# EAGLE design All (EAGLE 8.3.0)
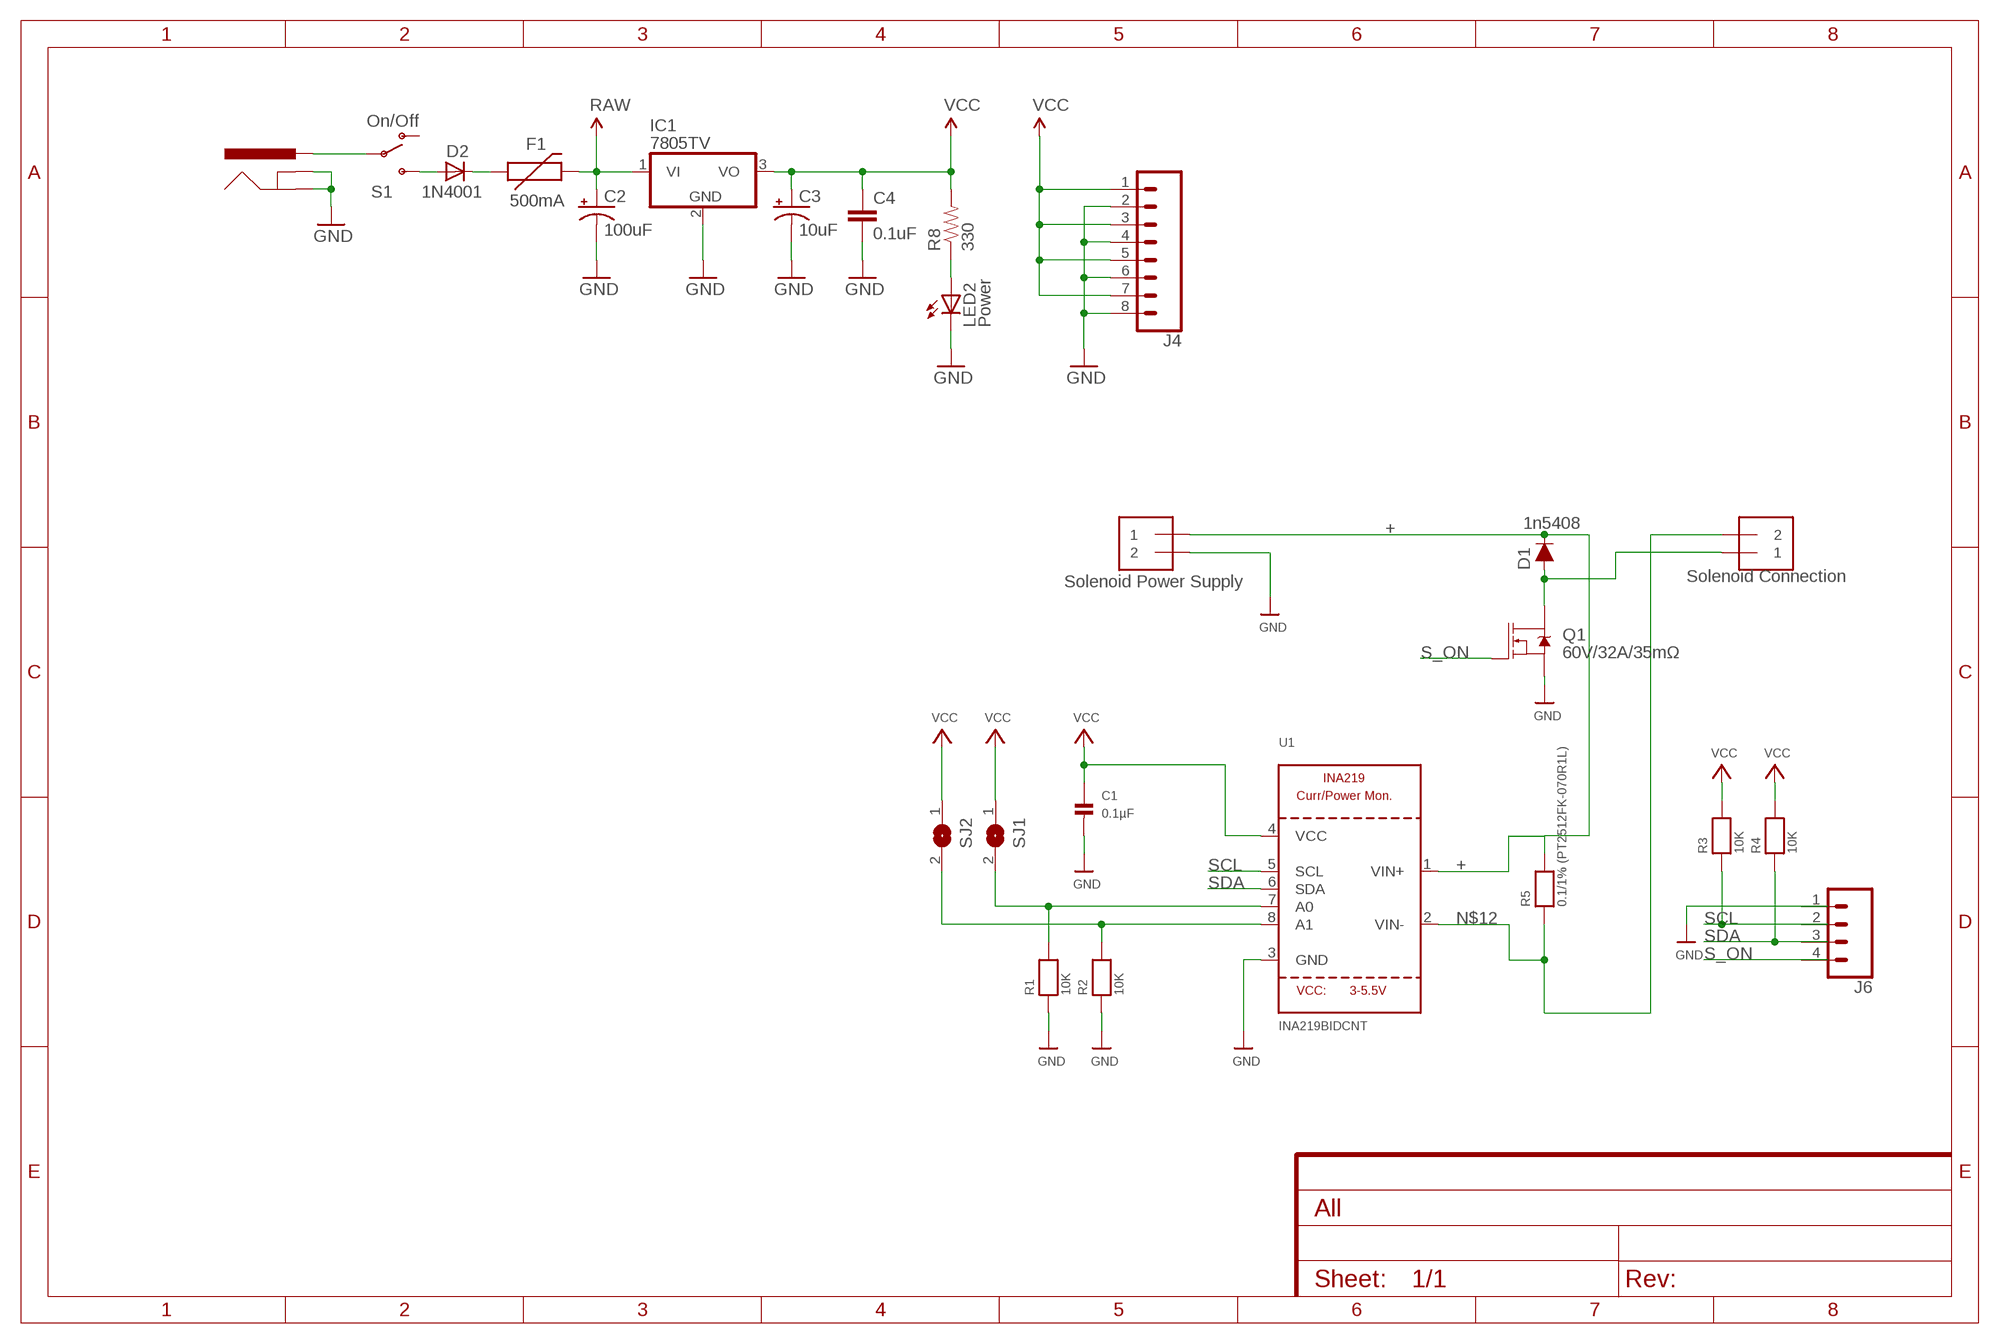
[diagram p0: schematic, sheet 1]

## Parts
C1  0.1µF  CAP_CERAMIC0805  [0805]
C2  100uF  CAP_POLPTH1  [CPOL-RADIAL-100UF-25V]
C3  10uF  CAP_POLPTH2  [CPOL-RADIAL-10UF-25V]
C4  0.1uF  CAPPTH2  [CAP-PTH-SMALL2]
D1  DIODE-1N4148  [DIODE-1N4148]
D2  1N4001  DIODEPTH  [DIODE-0.4]
F1  500mA  PTCPTH  [PTC]
IC1  7805TV  [TO220V]
J1  POWER_JACKPTH  [POWER_JACK_PTH]
J2  TERMBLOCK_1X2-3.5MM  [1X2-3.5MM]
J3  TERMBLOCK_1X2-3.5MM  [1X2-3.5MM]
J4  CONN_08"  [1X08]
J6  CONN_04  [1X04]
LED2  Power  LED5MM  [LED5MM]
Q1  60V/32A/35mΩ  MOSFET-NCH-FQP30N06L  [TO220V]
R1  10K  RESISTOR0805  [0805]
R2  10K  RESISTOR0805  [0805]
R3  10K  RESISTOR0805  [0805]
R4  10K  RESISTOR0805  [0805]
R5  0.1/1% (PT2512FK-070R1L)  RESISTOR2512  [2512]
R8  330  RESISTORPTH1  [AXIAL-0.3]
S1  On/Off  SWITCH-SPSTPTH  [SWITCH-SPST]
SJ1  SOLDERJUMPERREFLOW_NOPASTE  [SOLDERJUMPER_REFLOW_NOPASTE]
SJ2  SOLDERJUMPERREFLOW_NOPASTE  [SOLDERJUMPER_REFLOW_NOPASTE]
U1  INA219BIDCNT  INA219  [SOT23-8]

## Nets
+: D1.C J2.1 R5.2 U1.1(VIN+)
GND: C1.2 C2.2(-) C3.2(-) C4.2 IC1.2(GND) J1.GND J1.GNDBREAK J2.2 J4.2 J4.4 J4.6 J4.8 J6.1 LED2.K(C) Q1.3(S) R1.1 R2.1 U1.3(GND)
N$1: R2.2 SJ2.2 U1.8(A1)
N$2: R1.2 SJ1.2 U1.7(A0)
N$4: D1.A J3.1 Q1.2(D)
N$8: J1.PWR S1.2(P)
N$9: LED2.A R8.P$1
N$10: D2.C F1.P$1
N$11: D2.A S1.3(S)
N$12: J3.2 R5.1 U1.2(VIN-)
RAW: C2.1(+) F1.P$2 IC1.1(VI)
S_ON: J6.4 Q1.1(G)
SCL: J6.2 R3.1 U1.5(SCL)
SDA: J6.3 R4.1 U1.6(SDA)
VCC: C1.1 C3.1(+) C4.1 IC1.3(VO) J4.1 J4.3 J4.5 J4.7 R3.2 R4.2 R8.P$2 SJ1.1 SJ2.1 U1.4(VCC)
Unconnected: S1.1(O)

## Library data of the parts
C1 = microbuilder:CAP_CERAMIC: Ceramic Capacitors 0402 - 0402 Surface Mount Capacitors 16pF 50V 5% [Digikey: 445-4899-2-ND] 18pF 50V 5% [Digikey: 490-1281-2-ND] 22pF 50V 5% [Digikey: 490-1283-2-ND] 68pF 50V 5% [Digikey: 490-1289-2-ND] 0.1uF 10V 10% [Digikey: 490-1318-2-ND] 1.0uF 6.3V 10% [Digikey: 490-1320-2-ND] 0603 - 0603 Surface Mount Capacitors 16 pF 50V 5% [Digikey: 445-5051-2-ND] 22 pF 50V [Digikey: PCC220ACVTR-ND] 33 pF 50V 5% [Digikey: 490-1415-1-ND] 56pF 50V 5% [Digikey: 490-1421-1-ND] 220pF 50V 5% [Digikey: 445-1285-1-ND] 680 pF 50V 2200 pF 50V 5% C0G [Digikey: 445-1297-1-ND] 5600 pF 100V 5% X7R [Digikey: 478-3711-1-ND] 0.1 µF 25V 10% [Digikey: PCC2277TR-ND] 0.22 µF 16V 10% X7R [Digikey: 445-1318-1-ND] 1.0 µF 25V 10% [Digikey: 445-5146-2-ND] 0603 - RF Specific 3pF 250V +/-0.1pF RF [Digikey: 712-1347-1-ND] 18 pF 250V 5% [Digikey: 478-3505-1-ND or 712-1322-1-ND] 56 pF 250V 5% C0G RF [Digikey: 490-4867-1-ND] 68 pF 250V RF [Digikey: 490-4868-1-ND] 0805 - 0805 Surface Mount Capacitors 220 pF 250V 2% RF Ceramic Capacitor [Digikey: 712-1398-1-ND] 1000 pF 50V 2% NP0 Ceramic Capacitor [Digikey: 478-3760-1-ND] 0.1 µF 25V 10% Ceramic Capacitor [Digikey: PCC1828TR-ND] 1.0 µF 16V 10% Ceramic Capacitor[Digikey: 490-1691-2-ND] 10.0 µF 10V 10% Ceramic Capacitor[Digikey: 709-1228-1-ND] 10.0 uF 16V 10% Ceramic Capacitor [Digikey: 478-5165-2-ND] 47 uF 6.3V 20% Ceramic Capacitor [Digikey: 587-1779-1-ND or 399-5506-1-ND] 1206 - 1206 Surface Mount Capacitors 47uF 10V 20% Ceramic Capacitor [Digikey: 490-5528-1-ND or 399-5508-1-ND or 445-6010-1-ND] 100uF 6.3V -20%, +80% Y5V Ceramic Capacitor (Digikey: 490-4512-1-ND, Mouser: 81-GRM31CF50J107ZE1L)
C2 C3 = SparkFun:CAP_POL: Capacitor Polarized These are standard SMD and PTH capacitors. Normally 10uF, 47uF, and 100uF in electrolytic and tantalum varieties. Always verify the external diameter of the through hole cap, it varies with capacity, voltage, and manufacturer. The EIA devices should be standard.
C4 = SparkFun:CAP: Capacitor Standard 0603 ceramic capacitor, and 0.1" leaded capacitor.
D1 = SparkFun-DiscreteSemi:DIODE: Diode; PROD_ID: DIO-08378; TEMP: 1n5408; VALUE: 200mA/100V/1V
D2 = SparkFun:DIODE: Diode
F1 = SparkFun:PTC: Resettable Fuse PTC Resettable Fuse. Spark Fun Electronics SKU : COM-08357
IC1 = linear:78*: Positive VOLTAGE REGULATOR Source: http://cache.national.com/ds/LM/LM78L05.pdf http://www.fairchildsemi.com/ds/LM/LM7805.pdf
J1 = SparkFun:POWER_JACK: Power Jack This is the standard 5.5mm barrel jack for power. The PTH is the most common, proven, reliable, footprint. All others are experimental. The Slot footprint only works if the mill layer is transmitted to the PCB fab house so be warned. Spark Fun Electronics SKU : PRT-00119. Mating wall wart : TOL-00298 (and others)
J2 = microbuilder:TERMBLOCK_1X2: 3.5mm Terminal block http://www.ladyada.net/library/pcb/eaglelibrary.html; TEMP: Solenoid Power Supply
J3 = microbuilder:TERMBLOCK_1X2: 3.5mm Terminal block http://www.ladyada.net/library/pcb/eaglelibrary.html; TEMP: Solenoid Connection
J4 = SparkFun-Connectors:CONN_08: Multi connection point. Often used as Generic Header-pin footprint for 0.1 inch spaced/style header connections On any of the 0.1 inch spaced packages, you can populate with these: Break Away Headers - Straight <https://www.sparkfun.com/products/116> (PRT-00116) Break Away Male Headers - Right Angle <https://www.sparkfun.com/products/553> (PRT-00553) Female Headers <https://www.sparkfun.com/products/115> (PRT-00115) Break Away Headers - Machine Pin <https://www.sparkfun.com/products/117> (PRT-00117) Break Away Female Headers - Swiss Machine Pin <https://www.sparkfun.com/products/743> (PRT-00743) Arduino Stackable Header - 8 Pin <https://www.sparkfun.com/products/9279> (PRT-09279) For SCREWTERMINALS and SPRING TERMINALS visit here: Screw Terimnals on SparkFun.com <https://www.sparkfun.com/search/results?term=Screw+Terminals> (5mm/3.5mm/2.54mm spacing) This device is also useful as a general connection point to wire up your design to another part of your project. Our various solder wires solder well into these plated through hole pads. Hook-Up Wire - Assortment (Stranded, 22 AWG) <https://www.sparkfun.com/products/11375> (PRT-11375) Hook-Up Wire - Assortment (Solid Core, 22 AWG) <https://www.sparkfun.com/products/11367> (PRT-11367) View the entire wire category on our website here <https://www.sparkfun.com/categories/141> Special notes: Molex polarized connector foot print use with SKU : PRT-08231 with associated crimp pins and housings. 1MM SMD Version SKU: PRT-10208 NOTES ON THE VARIANTS LOCK and LOCK_LONGPADS... This footprint was designed to help hold the alignment of a through-hole component (i.e. 6-pin header) while soldering it into place. You may notice that each hole has been shifted either up or down by 0.005 of an inch from it's more standard position (which is a perfectly straight line). This slight alteration caused the pins (the squares in the middle) to touch the edges of the holes. Because they are alternating, it causes a "brace" to hold the component in place. 0.005 has proven to be the perfect amount of "off-center" position when using our standard breakaway headers. Although looks a little odd when you look at the bare footprint, once you have a header in there, the alteration is very hard to notice. Also,if you push a header all the way into place, it is covered up entirely on the bottom side.; PROD_ID: CONN-08438
J6 = SparkFun-Connectors:CONN_04: Multi connection point. Often used as Generic Header-pin footprint for 0.1 inch spaced/style header connections On any of the 0.1 inch spaced packages, you can populate with these: Break Away Headers - Straight <https://www.sparkfun.com/products/116> (PRT-00116) Break Away Male Headers - Right Angle <https://www.sparkfun.com/products/553> (PRT-00553) Female Headers <https://www.sparkfun.com/products/115> (PRT-00115) Break Away Headers - Machine Pin <https://www.sparkfun.com/products/117> (PRT-00117) Break Away Female Headers - Swiss Machine Pin <https://www.sparkfun.com/products/743> (PRT-00743) For SCREWTERMINALS and SPRING TERMINALS visit here: Screw Terimnals on SparkFun.com <https://www.sparkfun.com/search/results?term=Screw+Terminals> (5mm/3.5mm/2.54mm spacing) This device is also useful as a general connection point to wire up your design to another part of your project. Our various solder wires solder well into these plated through hole pads. Hook-Up Wire - Assortment (Stranded, 22 AWG) <https://www.sparkfun.com/products/11375> (PRT-11375) Hook-Up Wire - Assortment (Solid Core, 22 AWG) <https://www.sparkfun.com/products/11367> (PRT-11367) View the entire wire category on our website here <https://www.sparkfun.com/categories/141> Special notes: Molex polarized connector foot print use with SKU : PRT-08231 with associated crimp pins and housings. 1MM SMD Version SKU: PRT-10208; PROD_ID: CONN-09696
LED2 = SparkFun-Nate:LED
Q1 = SparkFun-DiscreteSemi:MOSFET-NCH: N-channel MOSFETs Voltage controlled devices that allow control of high current outputs. SparkFun Products: SparkFun OpenScale <https://www.sparkfun.com/products/13261> SparkFun Digital Sandbox <https://www.sparkfun.com/products/12651> SparkFun Monster Moto Shield <https://www.sparkfun.com/products/10182> SparkFun MOSFET Power Controller <https://www.sparkfun.com/products/11214>; PROD_ID: TRANS-10060
R1-R5 = microbuilder:RESISTOR: Resistors 0402 - 0402 Surface Mount Package 22 Ohm 1% 1/16W [Digikey: 311-22.0LRTR-ND] 33 Ohm 5% 1/16W 1.0K 5% 1/16W 1.5K 5% 1/16W 2.0K 1% 1/16W 10.0K 1% 1/16W [Digikey: 311-10.0KLRTR-ND] 10.0K 5% 1/16W [Digikey: RMCF0402JT10K0TR-ND] 12.1K 1% 1/16W [Digikey: 311-22.0LRTR-ND] 100.0K 5% 1/16W 0603 - 0603 Surface Mount Package 0 Ohm 1/10 Watt 1% Resistor 15 Ohm 1/10 Watt 1% Resistor 33 Ohm 1/10 Watt 1% Resistor 49.9 Ohm 1/10 Watt 1% Resistor 100 Ohm 1/10 Watt 1% Resistor 150 Ohm 1/10 Watt 1% Resistor 240 Ohm 1/10 Watt 1% Resistor 390 Ohm 1/10 Watt 1% Resistor 560 Ohm 1/10 Watt 1% Resistor 680 Ohm 1/10 Watt 1% Resistor 750 Ohm 1/10 Watt 1% Resistor 1.0K Ohm 1/10 Watt 1% Resistor 1.5K Ohm 1/10 Watt 1% Resistor 2.0K Ohm 1/10 Watt 1% Resistor 2.2K Ohm 1/10 Watt 1% Resistor 3.3K Ohm 1/10 Watt 1% Resistor 4.7K Ohm 1/10 Watt 1% Resistor 10.0K Ohm 1/10 Watt 1% Resistor 12.0K Ohm 1/10 Watt 1% Resistor 12.1K Ohm 1/10 Watt 1% Resistor 20.0K Ohm 1/10 Watt 1% Resistor 33.0K Ohm 1/10 Watt 1% Resistor 100.0K Ohm 1/10 Watt 1% Resistor 0805 - 0805 Surface Mount Package 0 Ohm 1/8 Watt 1% Resistor 33 Ohm 1/8 Watt 1% Resistor 100 Ohm 1/8 Watt 1% Resistor 150 Ohm 1/8 Watt 1% Resistor 200 Ohm 1/8 Watt 1% Resistor 240 Ohm 1/8 Watt 1% Resistor 330 Ohm 1/8 Watt 1% Resistor 390 Ohm 1/8 Watt 1% Resistor 470 Ohm 1/8 Watt 1% Resistor 1.0K Ohm 1/8 Watt 1% Resistor 1.5K Ohm 1/8 Watt 1% Resistor 2.0K Ohm 1/8 Watt 1% Resistor 4.7K Ohm 1/8 Watt 1% Resistor 5.1K Ohm 1/8 Watt 1% Resistor 5.6K Ohm 1/8 Watt 1% Resistor 10.0K Ohm 1/8 Watt 1% Resistor 22.0K Ohm 1/8 Watt 1% Resistor 33.0K Ohm 1/8 Watt 1% Resistor 100K Ohm 1/8 Watt 1% Resistor 1206 - 1206 Surface Mount Package 2012 - 2010 Surface Mount Package 0.11 Ohm 1/2 Watt 1% Resistor - Digikey: RHM.11UCT-ND
R8 = SparkFun:RESISTOR: Resistor Basic schematic elements and footprints for 0603, 1206, and PTH 1/10th watt (small) resistors.
S1 = SparkFun:SWITCH-SPST: SPST Switch Simple slide switch. Spark Fun Electronics SKU : COM-00102
SJ1 SJ2 = microbuilder:SOLDERJUMPER: SMD Solder JUMPER Solder the two pads together to create a connection, or remove the solder to break it. REFLOW - Use this footprint for solder paste and reflow ovens. WAVE - Use this footprint for hand-soldering (larger pads). CLOSED - Has a trace between the two pads to ensure it is closed by default. The trace needs to be cut to disable the jumper, and can be closed again by creating a solder bridge between the two pads.
U1 = microbuilder:INA219: INA219 - I2C Current/Power Monitor Voltage Range: 0-26V Accuracy: 0.5% Temperature: -40°C - 125°C

## Board
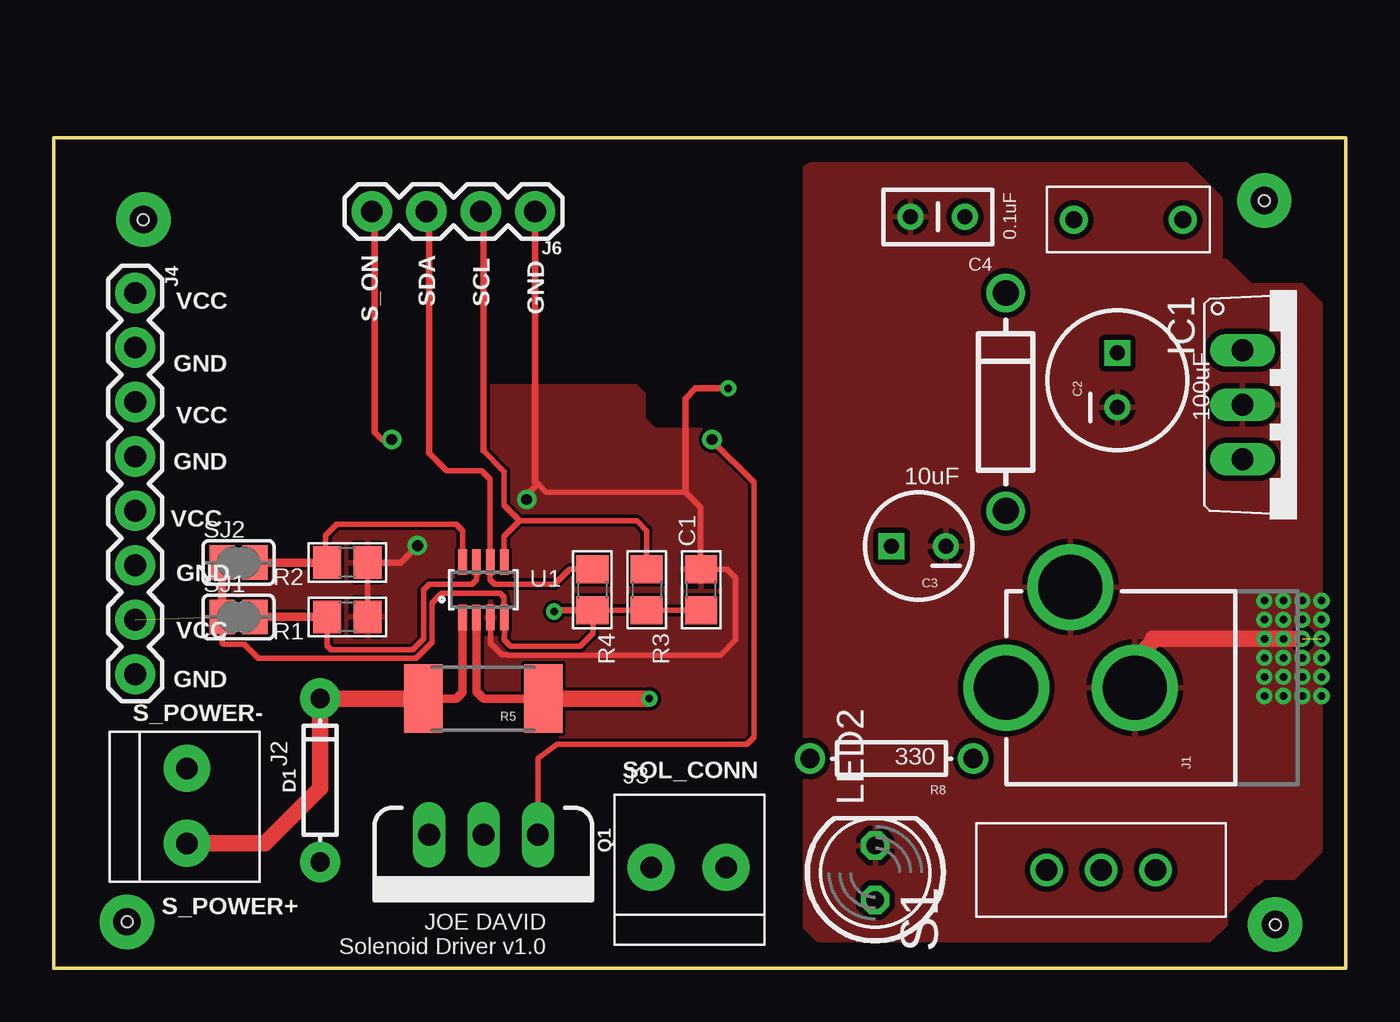
[diagram p1: board, top side]
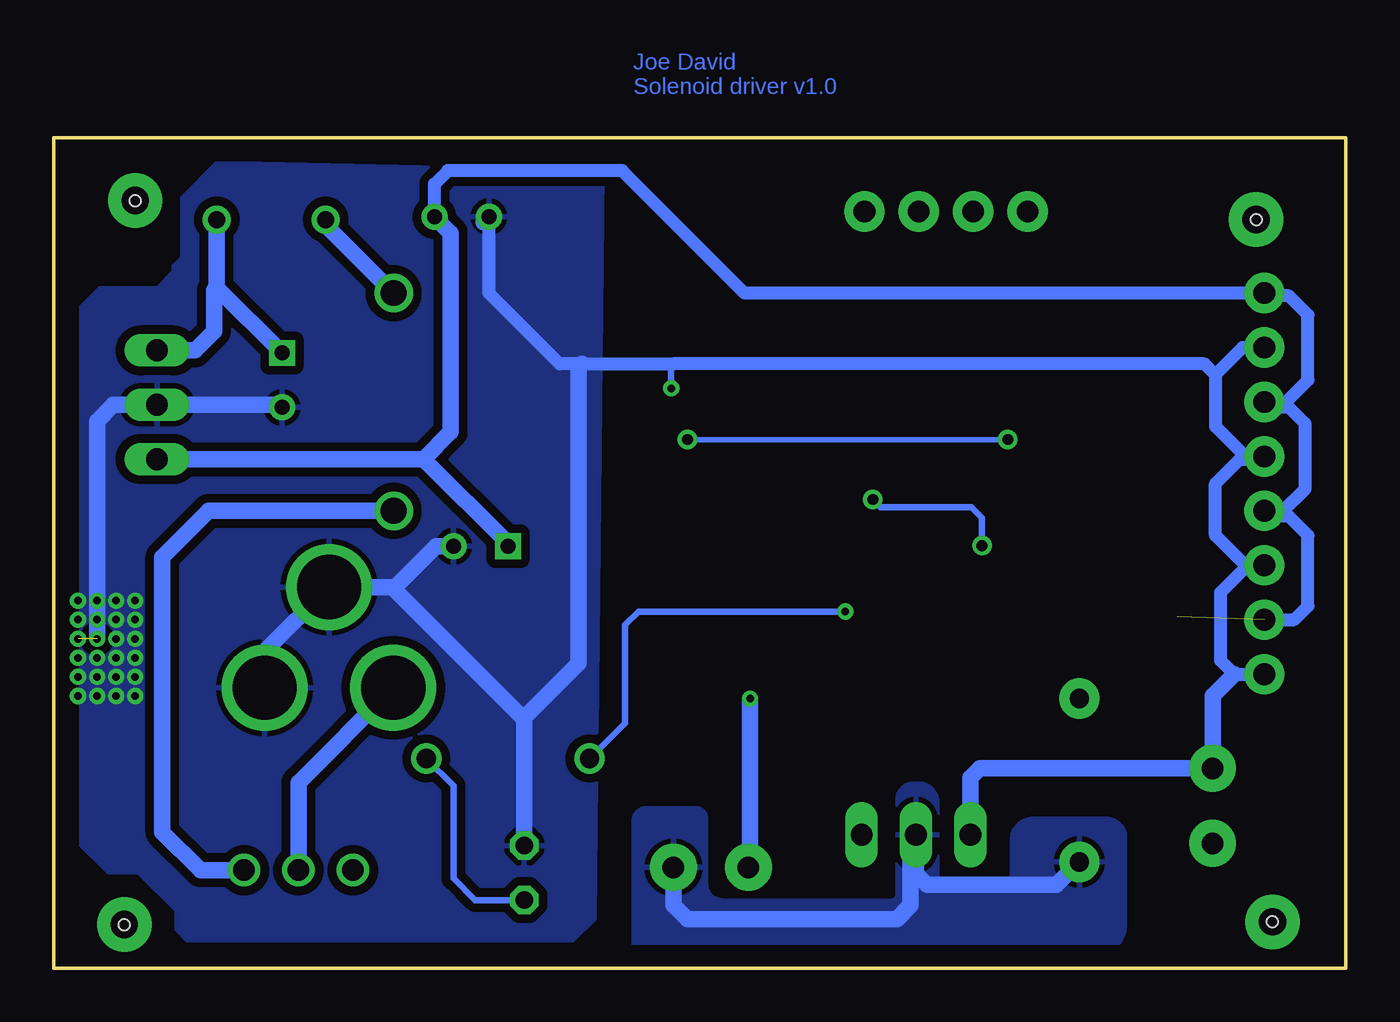
[diagram p2: board, bottom side, seen from below]

Size 60.33 x 38.73 mm. Coordinates in mm from the lower left corner, seen from the top.
Outline: 0,38.73 60.33,38.73 60.33,0 0,0 0,38.73
Copper layers (1*16): Top 0.035mm / dielectric 1.5mm / Bottom 0.035mm
Design rules "default": minimum track width 6mil, minimum drill 0.35mm, track to track 6mil, track to pad 6mil, pad to pad 6mil, via to via 6mil, smd to smd 6mil, copper to edge 40mil, drill to drill 6mil, minimum pad ring 10mil, minimum via ring 8mil, stop-mask expansion 4mil, vias tented up to drill 0mil, thermal gap 10mil
Holes 0.51 mm at 57.02,2.03 56.52,35.81 3.43,2.16 4.19,34.92

### Footprints (pad centres in the part's own frame; a part is rotated, then mirrored left to right if it is on the bottom)
0805 = smd 1.3 x 1.5: 1 -0.95,0; 2 0.95,0
CPOL-RADIAL-100UF-25V = drill 0.7 square: 1 1.27,0 | drill 0.7: 2 -1.27,0
CPOL-RADIAL-10UF-25V = drill 0.7 square: 1 1.27,0 | drill 0.7: 2 -1.27,0
CAP-PTH-SMALL2 = drill 0.7: 1 0,0; 2 2.54,0
DIODE-1N4148 = drill 0.9 pad 1.88: A -3.81,0; C 3.81,0
DIODE-0.4 = drill 1.2: A 0,0; C 10.16,0
PTC = drill 0.8: P$1 -2.54,0; P$2 2.54,0
TO220V = drill 1.016 long: 1 -2.54,-2.54; 2 0,-2.54; 3 2.54,-2.54
POWER_JACK_PTH = drill 2.997: GND 0,7.7; GNDBREAK 4.7,10.7; PWR 0,13.7
1X2-3.5MM = drill 1 pad 2.184: 1 1.8,0; 2 -1.7,0
1X08 = drill 1.016 pad 1.88: 1 0,0; 2 2.54,0; 3 5.08,0; 4 7.62,0; 5 10.16,0; 6 12.7,0; 7 15.24,0; 8 17.78,0
1X04 = drill 1.016 pad 1.88: 1 0,0; 2 2.54,0; 3 5.08,0; 4 7.62,0
LED5MM = drill 0.813 octagon: A -1.27,0; K 1.27,0
TO220V' = drill 1.016 long: 1 -2.54,0; 2 0,0; 3 2.54,0
2512 = smd 1.8 x 3.2: 1 -2.8,0; 2 2.8,0
AXIAL-0.3 = drill 0.9: P$1 -3.81,0; P$2 3.81,0
SWITCH-SPST = drill 1.016: 1 0,2.54; 2 0,0; 3 0,-2.54
SOLDERJUMPER_REFLOW_NOPASTE = smd 1.168 x 1.6: 1 -0.762,0; 2 0.762,0
SOT23-8 = smd 0.4 x 1.2: 1 -0.975,-1.3; 2 -0.325,-1.3; 3 0.325,-1.3; 4 0.975,-1.3; 5 0.975,1.3; 6 0.325,1.3; 7 -0.325,1.3; 8 -0.975,1.3

### Placement (x,y rotation side)
C1  30.23,17.65 90 top
C2  49.66,27.43 90 top
C3  40.39,19.68 180 top
C4  42.55,35.05 180 top
D1  12.45,8.76 90 top
D2  44.45,21.34 90 top
F1  50.17,34.92 0 top
IC1  58.04,26.29 270 top
J1  58.17,13.08 90 top
J2  6.22,7.62 270 top
J3  29.59,4.7 0 top
J4  3.81,31.5 270 top
J6  22.48,35.31 180 top
LED2  38.35,4.45 90 top
Q1  60V/32A/35mΩ  [TO220V']  20.07,6.22 180 top
R1  13.72,16.38 180 top
R2  13.72,18.92 180 top
R3  27.69,17.65 270 top
R4  25.15,17.65 270 top
R5  20.07,12.57 180 top
R8  39.12,9.78 180 top
S1  48.9,4.57 90 top
SJ1  8.64,16.38 0 top
SJ2  8.64,18.92 0 top
U1  20.07,17.65 0 top

### Tracks (layer width: path | path; a pad name or v marks a point on that pad's centre or on a via)
+
  Top 0.406: U1.1 19.09,12.87 18.8,12.57 R5.2
  Top 0.762: 17.53,12.31 R5.2 D1.C 12.45,8.38 9.88,5.82 J2.1
GND  (via drill 0.35, 0.51)  (1 unrouted)
  Top 0.254: R1.1 R2.1 | U1.3 20.39,15.16 20.94,14.61 21.16,14.61 21.17,14.61 31.13,14.61 31.84,15.31 31.84,18.21 31.44,18.61 C1.2 | C1.2 | 22.61,22.59 22.99,22.21 29.49,22.21 30.19,21.51 30.19,18.66 C1.2
  Top 0.305: R2.1 16.2,18.92 v16.99,19.71 | v22.09,21.86 22.09,22.07 22.59,22.57 | 22.59,22.57 22.61,22.59 | 29.49,22.21 29.49,26.56 29.97,27.05 v31.5,27.05 | J6.1 22.48,22.68 22.59,22.57
  Top 0.762: v58.29,15.37 51.31,15.37 51.31,15.24 50.55,14.48
  Bottom 0.305: v16.99,19.71 16.99,21.01 17.49,21.51 21.74,21.51 v22.09,21.86 | v31.5,27.05 31.5,28.11 31.41,28.19
  Bottom 0.61: J4.8 5.21,13.72 5.84,14.35 5.84,17.53 4.7,18.67 3.94,18.67 J4.6 4.7,18.8 6.1,20.19 6.1,22.61 4.95,23.75 3.94,23.75 J4.4 4.7,23.88 6.1,25.27 6.1,27.69 | J4.2 4.83,28.96 6.1,27.69 | 6.1,27.69 6.6,28.19 31.41,28.19 35.67,28.19 36.7,28.19 40.01,31.5 40.01,34.54 40.26,34.8
  Bottom 0.762: 40.26,34.8 C4.2 | J1.GND 50.47,14.78 J1.GNDBREAK 44.53,17.78 44.45,17.7 | LED2.K 38.35,11.6 | 44.45,17.7 38.35,11.6 | C3.2 42.47,19.68 44.45,17.7 | C2.2 49.78,26.29 IC1.2 57.53,26.29 58.29,25.53 v58.29,15.37 | 38.35,11.6 38.35,11.68 35.81,14.22 35.81,28.05 35.67,28.19 | Q1.3 17.53,8.89 17.1,9.32 J2.2 6.22,12.7 5.21,13.72
  other vias: 56.52,17.14 57.4,17.14 58.29,17.14 59.18,17.14 56.52,16.26 57.4,16.26 58.29,16.26 59.18,16.26 59.18,15.37 57.4,15.37 56.52,15.37 56.52,14.48 57.4,14.48 58.29,14.48 59.18,14.48 56.52,13.59 57.4,13.59 56.52,12.7 57.4,12.7 58.29,13.59 58.29,12.7 59.18,12.7 59.18,13.59
  pour Bottom (isolate 0.406): 52.71,37.59 54.36,35.94 54.36,33.15 54.74,32.77 54.74,32.51 55.5,31.75 58.17,31.75 59.05,30.86 59.05,5.71 57.79,4.45 56.39,4.45 54.61,2.67 54.61,1.78 54.1,1.27 36.07,1.27 35.05,2.29 34.67,37.21
  pour Top (isolate 0.254): 35.69,37.72 52.83,37.59 54.48,35.94 54.48,33.02 54.74,33.02 55.88,31.88 58.29,31.88 59.18,30.99 59.18,5.46 57.91,4.19 56.52,4.19 56.26,3.94 56.13,3.94 54.74,2.54 54.74,2.03 53.98,1.27 35.69,1.27 35.05,1.91 35.05,37.34
  pour Top: 8.38,9.91 8.38,26.29 9.27,27.18 27.18,27.18 27.56,26.8 27.56,25.65 28.07,25.15 32.51,25.15 arc-90 33.15,24.51 33.15,9.91 arc-90 31.75,8.51 9.78,8.51 arc-90
N$1
  Top 0.254: U1.8 19.09,20.41 18.8,20.7 13.21,20.7 12.7,20.19 12.7,18.99 R2.2
  Top 0.406: R2.2 SJ2.2
N$2
  Top 0.254: R1.2 12.77,15.05 12.95,14.86 16.76,14.86 17.27,15.37 17.27,17.65 17.53,17.91 19.53,17.91 19.74,18.11 U1.7
  Top 0.406: SJ1.2 R1.2
N$3  (via drill 1.27 pad 2.54)
  other vias: 57.02,2.03
N$4
  Bottom 0.762: D1.A 13.51,3.89 19.56,3.89 20.07,4.39 Q1.2 20.32,5.97 20.32,2.92 20.95,2.29 30.73,2.29 31.39,2.94 J3.1
  pour Bottom: 33.4,1.02 arc-90 33.27,1.14 33.27,6.86 arc90 32.64,7.49 30.35,7.49 arc90 29.84,6.99 29.84,3.94 arc-90 29.08,3.17 21.21,3.17 arc-90 20.95,3.43 20.95,7.87 arc90 20.19,8.64 19.94,8.64 arc90 19.05,7.75 19.05,4.06 arc-90 18.54,3.56 16,3.56 arc-90 15.62,3.94 15.62,5.97 arc90 14.61,6.99 11.18,6.99 arc90 10.29,6.1 10.29,2.03 arc90 11.68,0.64 33.15,0.64 arc90 33.4,0.89
N$5  (via drill 1.27 pad 2.54)
  other vias: 56.52,35.81
N$6  (via drill 1.27 pad 2.54)
  other vias: 3.43,2.16
N$7  (via drill 1.27 pad 2.54)
  other vias: 4.19,34.92
N$8
  Bottom 0.762: S1.2 48.9,8.65 J1.PWR
N$9
  Bottom 0.305: LED2.A 40.64,3.17 41.66,4.19 41.66,8.51 R8.P$1
N$10
  Bottom 0.762: F1.P$1 47.62,34.67 D2.C
N$11
  Bottom 0.762: S1.3 53.47,4.57 55.25,6.35 55.25,19.18 53.09,21.34 D2.A
N$12  (via drill 0.35)
  Top 0.406: U1.2 19.74,12.9 20.07,12.57 R5.1
  Top 0.762: R5.1 v27.81,12.57
  Bottom 0.762: v27.81,12.57 27.81,4.78 J3.2
N$23  (via drill 0.35)
  other vias: 58.29,15.37
RAW
  Bottom 0.762: 52.58,34.8 F1.P$2 52.71,31.75 | 52.71,31.75 C2.1 | IC1.1 53.72,28.83 52.83,29.72 52.83,31.62 52.71,31.75
S_ON  (via drill 0.51)
  Top 0.016: 30.74,24.61 v30.74,24.66
  Top 0.254: Q1.1 22.61,9.79 23.51,10.45 32.37,10.45 32.69,10.76 32.69,22.66 30.74,24.61 | v15.79,24.66 15.34,24.66 14.99,25.01
  Top 0.305: 14.99,25.01 14.99,35.18 J6.4
  Bottom 0.254: v30.74,24.66 v15.79,24.66 15.74,24.66
SCL
  Top 0.254: 20.07,24.13 21.04,23.16 21.04,21.59 21.76,20.86 | U1.5 21.04,20.14 21.76,20.86 | R3.1 27.69,20.41 27.24,20.86 21.76,20.86
  Top 0.305: 20.07,24.13 20.07,35.18 J6.2
SDA
  Top 0.254: 17.53,24.02 18.34,23.21 19.99,23.21 20.39,22.81 U1.6 20.39,18.11 20.59,17.91 23.39,17.91 24.08,18.6 R4.1
  Top 0.305: 17.53,24.02 17.53,35.18 J6.3
VCC  (via drill 0.35)  (1 unrouted)
  Top 0.254: SJ1.1 7.87,15.18 7.94,15.11 8.89,15.11 9.55,14.45 16.93,14.45 17.68,15.2 17.68,17.05 18.12,17.5 20.85,17.5 21.04,17.31 U1.4 21.04,15.52 21.04,15.51 21.04,15.31 21.34,15.01 24.59,15.01 25.19,15.61 25.19,16.66 R4.2 R3.2 C1.1
  Top 0.305: R4.2 23.43,16.7 v23.37,16.64
  Top 0.406: SJ2.1 SJ1.1
  Bottom 0.305: R8.P$2 33.66,11.43 33.66,16.01 33.03,16.64 v23.37,16.64
  Bottom 0.61: J4.7 2.41,16.26 1.78,16.89 1.78,20.19 2.67,21.08 3.56,21.08 J4.5 2.92,21.34 1.91,22.35 1.91,25.4 2.67,26.16 3.56,26.16 J4.3 2.79,26.42 1.78,27.43 1.78,30.48 2.67,31.37 3.68,31.37 J4.1 28.07,31.5 33.78,37.21 41.91,37.21 42.55,36.58 C4.1
  Bottom 0.762: 43.05,23.75 41.78,25.02 41.78,34.29 C4.1 | IC1.3 43.05,23.75 | C3.1 39.12,19.81 43.05,23.75

### Text on the board
Bottom: Joe David / Solenoid driver v1.0
tPlace: S_ON | SDA | SCL | GND | VCC | GND | VCC | GND | VCC | GND | VCC | GND | S_POWER- | SOL_CONN | S_POWER+ | JOE DAVID / Solenoid Driver v1.0